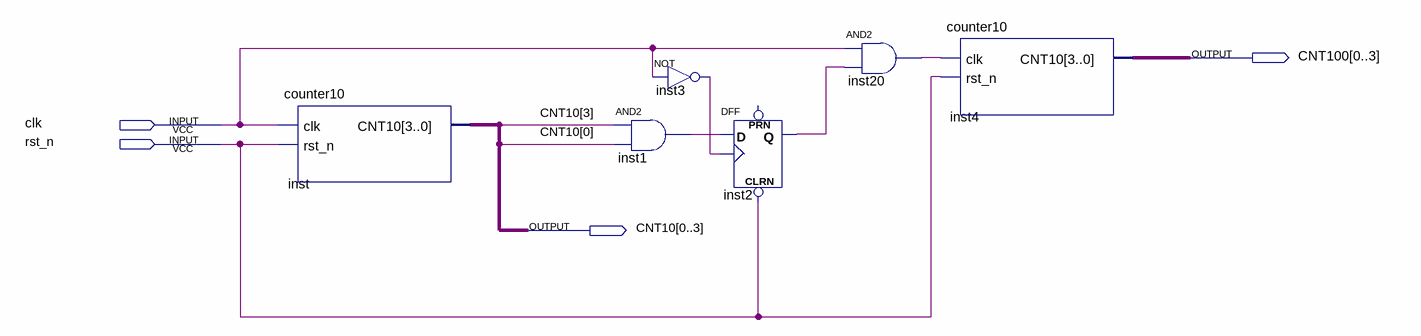
[diagram p0: schematic sheet]
// Quartus schematic week5_ex1.bdf as structural Verilog: 6 symbols, 4 pins
module week5_ex1 (
  input  clk,
  input  rst_n,
  output [0:3] CNT100,
  output [0:3] CNT10
);

  wire inst1_out, inst2_q, inst3_out, inst20_out;

  counter10 inst (.clk(clk), .rst_n(rst_n), .CNT10(CNT10));
  and inst1 (inst1_out, CNT10[3], CNT10[0]);
  not inst3 (inst3_out, clk);
  DFF inst2 (.CLRN(rst_n), .CLK(inst3_out), .D(inst1_out), .Q(inst2_q));  // open: PRN
  and inst20 (inst20_out, clk, inst2_q);
  counter10 inst4 (.clk(inst20_out), .rst_n(rst_n), .CNT10(CNT100));
endmodule
